# Altium schematic sheet BMS_STM32.SchDoc
size 431 x 279 mm; SheetNumber: 1; SheetTotal: 5
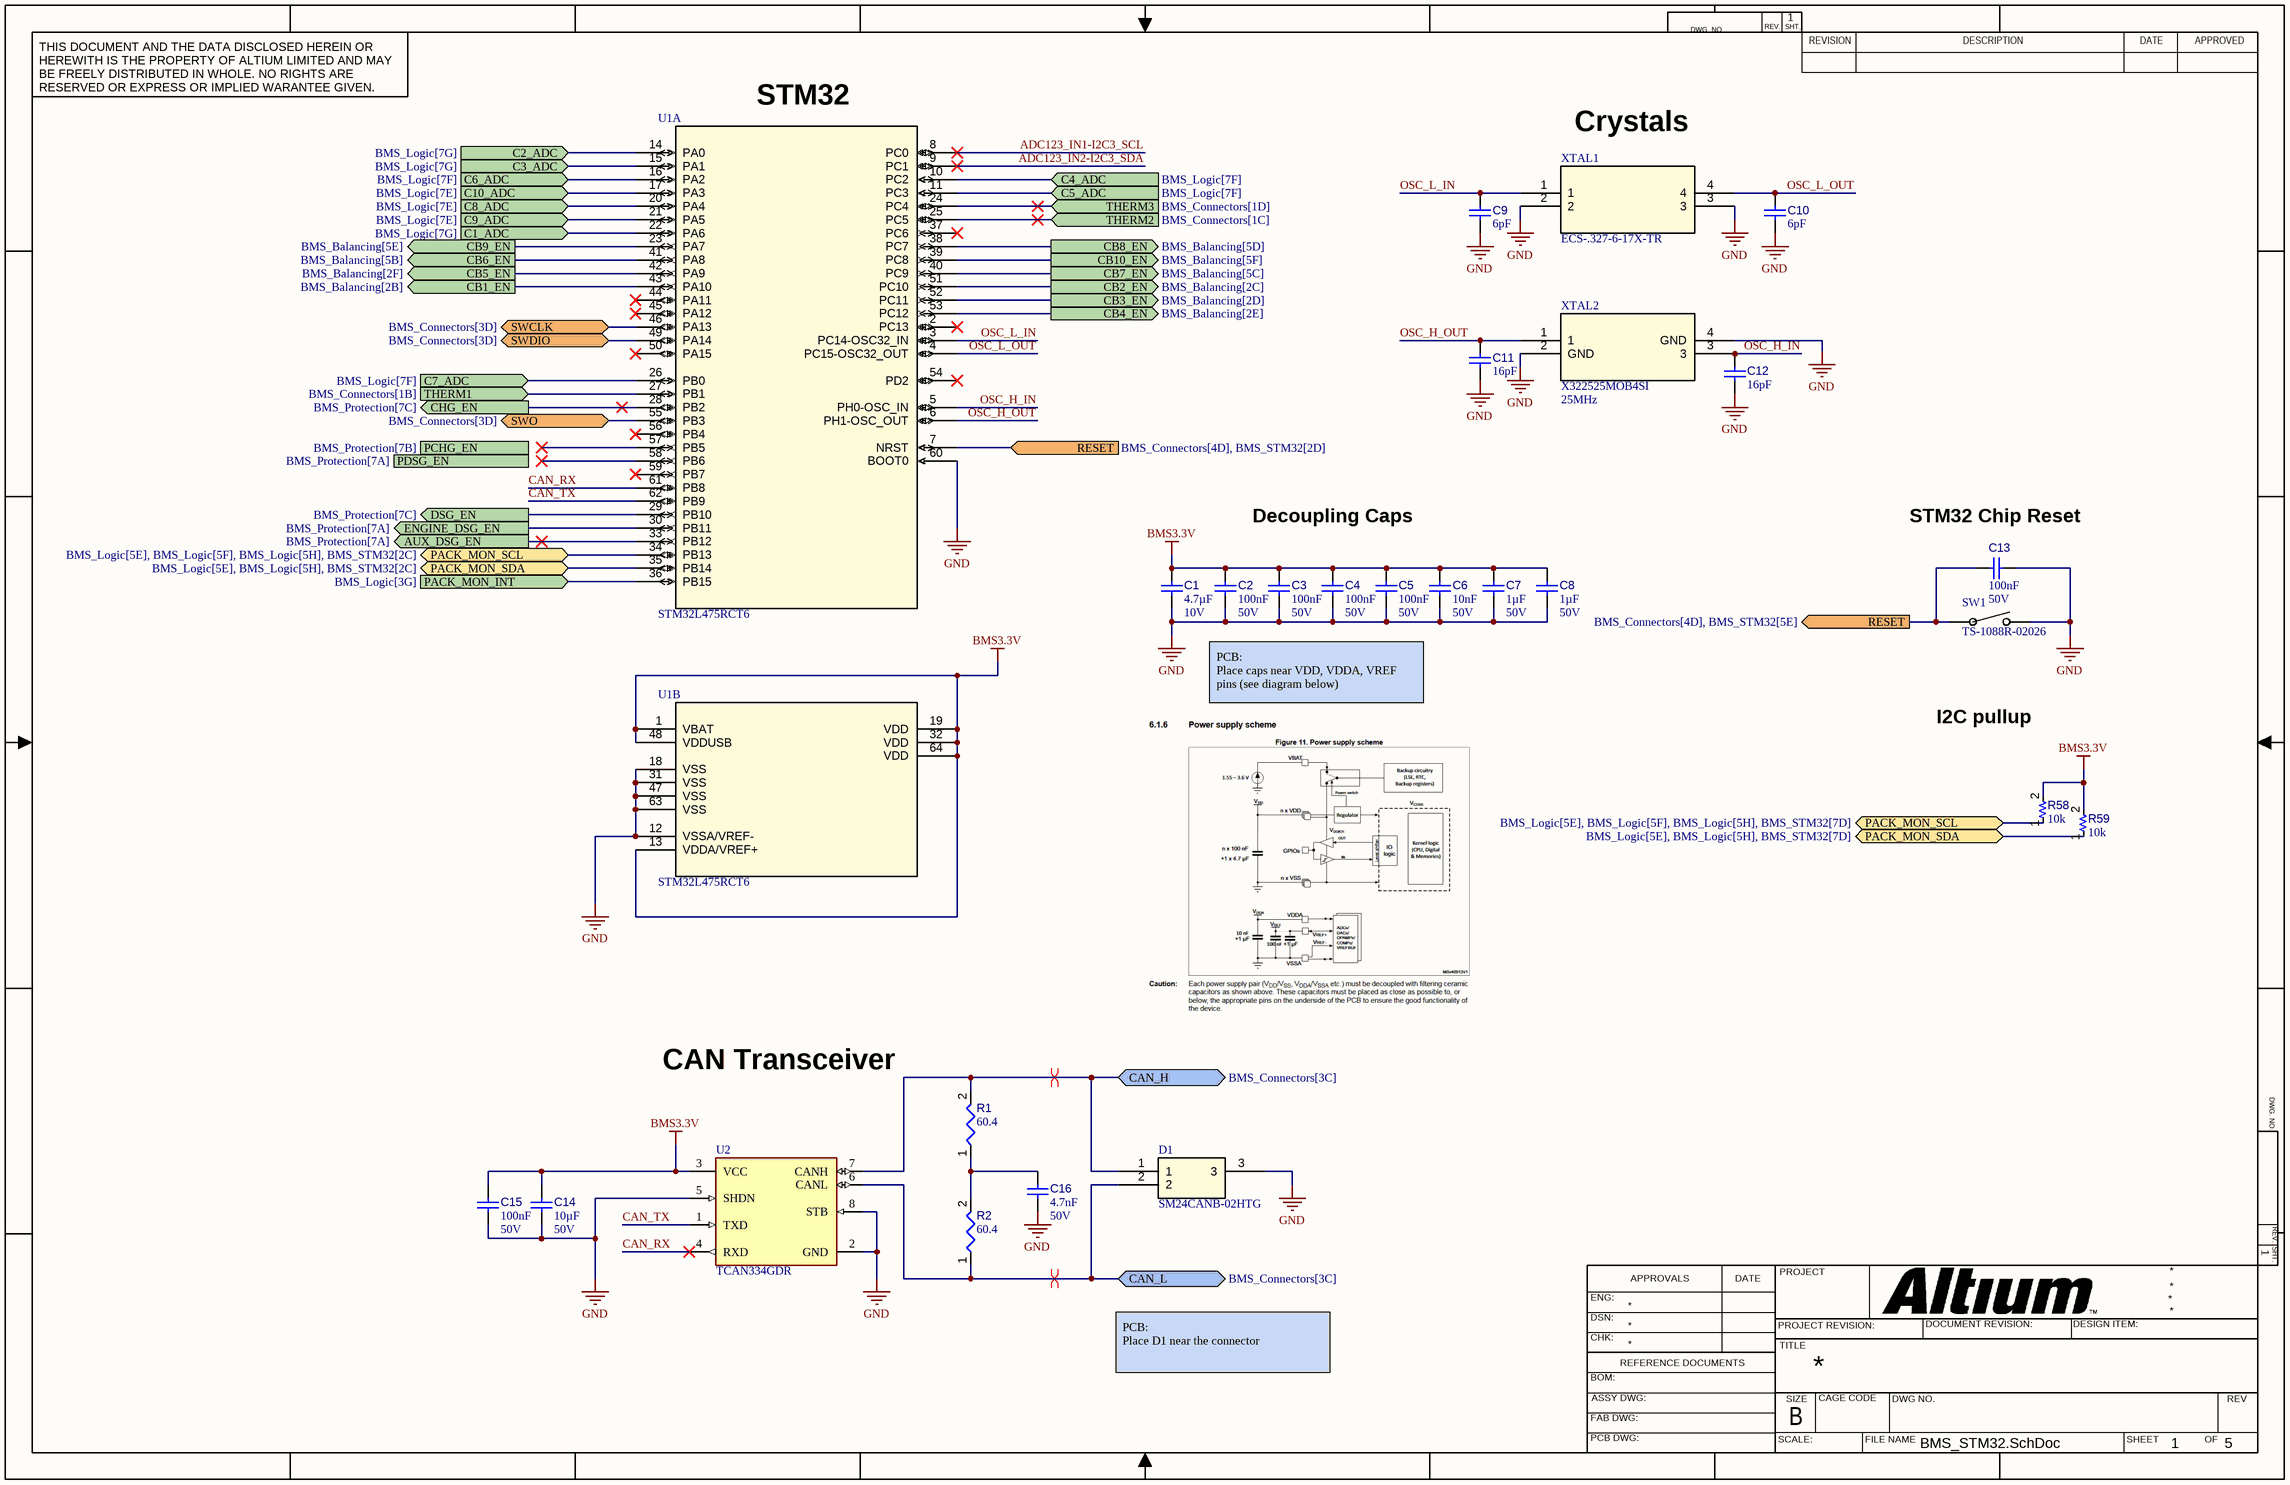
[diagram p0: BMS_STM32.SchDoc]

## Parts
C1  value 4.7µF  Voltage Rating: 10V  [CAPC0603(1608)100_L]  (hidden comment: Capacitor 4.7µF +/-20% 10V 0603)
C2  value 100nF  Voltage Rating: 50V  [CAPC0402(1005)60_L]  (hidden comment: Capacitor 100nF +/-20% 50V 0402)
C3  value 100nF  Voltage Rating: 50V  [CAPC0402(1005)60_L]  (hidden comment: Capacitor 100nF +/-20% 50V 0402)
C4  value 100nF  Voltage Rating: 50V  [CAPC0402(1005)60_L]  (hidden comment: Capacitor 100nF +/-20% 50V 0402)
C5  value 100nF  Voltage Rating: 50V  [CAPC0402(1005)60_L]  (hidden comment: Capacitor 100nF +/-20% 50V 0402)
C6  value 10nF  Voltage Rating: 50V  [CAPC0402(1005)60_L]  (hidden comment: Capacitor 10nF +/-20% 50V 0402)
C7  value 1µF  Voltage Rating: 50V  [CAPC0603(1608)100_L]  (hidden comment: Capacitor 1µF +/-40% 50V 0603)
C8  value 1µF  Voltage Rating: 50V  [CAPC0603(1608)100_L]  (hidden comment: Capacitor 1µF +/-40% 50V 0603)
C9  value 6pF  [CAPC1709X04N]  (hidden comment: Yageo CC0603CRNPO9BN6R0)
C10  value 6pF  [CAPC1709X04N]  (hidden comment: Yageo CC0603CRNPO9BN6R0)
C11  value 16pF  [CAPC1709X04N]  (hidden comment: Yageo CC0603JRNPO9BN160)
C12  value 16pF  [CAPC1709X04N]  (hidden comment: Yageo CC0603JRNPO9BN160)
C13  value 100nF  Voltage Rating: 50V  [CAPC0402(1005)60_L]  (hidden comment: Capacitor 100nF +/-20% 50V 0402)
C14  value 10µF  Voltage Rating: 50V  [CAPC0805(2012)145_L]  (hidden comment: Samsung Electro-Mechanics CL21A106KBYQNNE)
C15  value 100nF  Voltage Rating: 50V  [CAPC0402(1005)60_L]  (hidden comment: Capacitor 100nF +/-20% 50V 0402)
C16  value 4.7nF  Voltage Rating: 50V  [CAPC1709X04N]  (hidden comment: yageo CC0603KRX7R9BB472)
D1  SM24CANB-02HTG  [SOT23-3_SM24CANB-02HTG_LTF]
R1  value 60.4  [RESC1709X04N]  (hidden comment: yageo RC0603FR-0760R4L)
R2  value 60.4  [RESC1709X04N]  (hidden comment: yageo RC0603FR-0760R4L)
R58  value 10k  [RESC0402(1005)_L]  (hidden comment: RC0402FR-0710KL)
R59  value 10k  [RESC0402(1005)_L]  (hidden comment: RC0402FR-0710KL)
SW1  TS-1088R-02026  [SW_TS-1088R-02026_XNP]
U1  STM32L475RCT6  [LQFP64-10x10mm]  (parts A,B of 2)
U2  TCAN334GDR  [FP-D0008A-IPC_B]
XTAL1  ECS-.327-6-17X-TR  [XTAL_7X-TR_ECS]
XTAL2  X322525MOB4SI  Frequency: 25MHz  [SMT_MOB4SI_YXC]

## Ports
AUX_DSG_EN (out, see BMS_Protection[7A]), C1_ADC (in, see BMS_Logic[7G]), C2_ADC (in, see BMS_Logic[7G]), C3_ADC (in, see BMS_Logic[7G]), C4_ADC (in, see BMS_Logic[7F]), C5_ADC (in, see BMS_Logic[7F]), C6_ADC (in, see BMS_Logic[7F]), C7_ADC (in, see BMS_Logic[7F]), C8_ADC (in, see BMS_Logic[7E]), C9_ADC (in, see BMS_Logic[7E]), C10_ADC (in, see BMS_Logic[7E]), CAN_H (bidir, see BMS_Connectors[3C]), CAN_L (bidir, see BMS_Connectors[3C]), CB1_EN (out, see BMS_Balancing[2B]), CB2_EN (out, see BMS_Balancing[2C]), CB3_EN (out, see BMS_Balancing[2D]), CB4_EN (out, see BMS_Balancing[2E]), CB5_EN (out, see BMS_Balancing[2F]), CB6_EN (out, see BMS_Balancing[5B]), CB7_EN (out, see BMS_Balancing[5C]), CB8_EN (out, see BMS_Balancing[5D]), CB9_EN (out, see BMS_Balancing[5E]), CB10_EN (out, see BMS_Balancing[5F]), CHG_EN (out, see BMS_Protection[7C]), DSG_EN (out, see BMS_Protection[7C]), ENGINE_DSG_EN (out, see BMS_Protection[7A]), PACK_MON_INT (in, see BMS_Logic[3G]), PACK_MON_SCL (bidir, see BMS_Logic[5E], BMS_Logic[5F], BMS_Logic[5H], BMS_STM32[2C]), PACK_MON_SCL (bidir, see BMS_Logic[5E], BMS_Logic[5F], BMS_Logic[5H], BMS_STM32[7D]), PACK_MON_SDA (bidir, see BMS_Logic[5E], BMS_Logic[5H], BMS_STM32[2C]), PACK_MON_SDA (bidir, see BMS_Logic[5E], BMS_Logic[5H], BMS_STM32[7D]), PCHG_EN (out, see BMS_Protection[7B]), PDSG_EN (out, see BMS_Protection[7A]), RESET (in, see BMS_Connectors[4D], BMS_STM32[2D]), RESET (out, see BMS_Connectors[4D], BMS_STM32[5E]), SWCLK (bidir, see BMS_Connectors[3D]), SWDIO (bidir, see BMS_Connectors[3D]), SWO (bidir, see BMS_Connectors[3D]), THERM1 (in, see BMS_Connectors[1B]), THERM2 (in, see BMS_Connectors[1C]), THERM3 (in, see BMS_Connectors[1D])

## Nets
BMS3.3V: C1.1 C2.2 C3.2 C4.2 C5.2 C6.1 C7.1 C8.1 C14.1 C15.1 R58.2 R59.2 U1.1(VBAT) U1.13(VDDA/VREF+) U1.19(VDD) U1.32(VDD) U1.48(VDDUSB) U1.64(VDD) U2.3(VCC)
GND: C1.2 C2.1 C3.1 C4.1 C5.1 C6.2 C7.2 C8.2 C9.2 C10.2 C11.2 C12.1 C13.1 C14.2 C15.2 C16.2 D1.3 SW1.2 U1.12(VSSA/VREF-) U1.18(VSS) U1.31(VSS) U1.47(VSS) U1.60(BOOT0) U1.63(VSS) U2.2(GND) U2.5(SHDN) U2.8(STB) XTAL1.2 XTAL1.3 XTAL2.2(GND) XTAL2.4(GND)
ADC123_IN1-I2C3_SCL: U1.8(PC0)
ADC123_IN2-I2C3_SDA: U1.9(PC1)
AUX_DSG_EN: U1.33(PB12) ; port AUX_DSG_EN
C1_ADC: U1.22(PA6) ; port C1_ADC
C2_ADC: U1.14(PA0) ; port C2_ADC
C3_ADC: U1.15(PA1) ; port C3_ADC
C4_ADC: U1.10(PC2) ; port C4_ADC
C5_ADC: U1.11(PC3) ; port C5_ADC
C6_ADC: U1.16(PA2) ; port C6_ADC
C7_ADC: U1.26(PB0) ; port C7_ADC
C8_ADC: U1.20(PA4) ; port C8_ADC
C9_ADC: U1.21(PA5) ; port C9_ADC
C10_ADC: U1.17(PA3) ; port C10_ADC
CAN_H: D1.1 R1.2 U2.7(CANH) ; port CAN_H
CAN_L: D1.2 R2.1 U2.6(CANL) ; port CAN_L
CAN_RX: U1.61(PB8) U2.4(RXD)
CAN_TX: U1.62(PB9) U2.1(TXD)
CB1_EN: U1.43(PA10) ; port CB1_EN
CB2_EN: U1.51(PC10) ; port CB2_EN
CB3_EN: U1.52(PC11) ; port CB3_EN
CB4_EN: U1.53(PC12) ; port CB4_EN
CB5_EN: U1.42(PA9) ; port CB5_EN
CB6_EN: U1.41(PA8) ; port CB6_EN
CB7_EN: U1.40(PC9) ; port CB7_EN
CB8_EN: U1.38(PC7) ; port CB8_EN
CB9_EN: U1.23(PA7) ; port CB9_EN
CB10_EN: U1.39(PC8) ; port CB10_EN
CHG_EN: U1.28(PB2) ; port CHG_EN
DSG_EN: U1.29(PB10) ; port DSG_EN
ENGINE_DSG_EN: U1.30(PB11) ; port ENGINE_DSG_EN
OSC_H_IN: C12.2 U1.5(PH0-OSC_IN) XTAL2.3
OSC_H_OUT: C11.1 U1.6(PH1-OSC_OUT) XTAL2.1
OSC_L_IN: C9.1 U1.3(PC14-OSC32_IN) XTAL1.1
OSC_L_OUT: C10.1 U1.4(PC15-OSC32_OUT) XTAL1.4
PACK_MON_INT: U1.36(PB15) ; port PACK_MON_INT
PACK_MON_SCL: R58.1 U1.34(PB13) ; port PACK_MON_SCL
PACK_MON_SDA: R59.1 U1.35(PB14) ; port PACK_MON_SDA
RESET: C13.2 SW1.1 U1.7(NRST) ; port RESET
SWCLK: U1.46(PA13) ; port SWCLK
SWDIO: U1.49(PA14) ; port SWDIO
SWO: U1.55(PB3) ; port SWO
THERM1: U1.27(PB1) ; port THERM1
THERM2: U1.25(PC5) ; port THERM2
THERM3: U1.24(PC4) ; port THERM3
NetC16_1: C16.1 R1.1 R2.2

Not connected (* = marked no-connect by the designer): U1 2(PC13)* 37(PC6)* 44(PA11)* 45(PA12)* 50(PA15)* 54(PD2)* 56(PB4)* 57(PB5)* 58(PB6)* 59(PB7)*

## Layout directives
differential pair: CAN_H, CAN_L

## Notes on the sheet
- (near U1) STM32
- Crystals
- Decoupling Caps
- (near C13) STM32 Chip Reset
- PCB:
  Place caps near VDD, VDDA, VREF pins (see diagram below)
- I2C pullup
- CAN Transceiver
- PCB:
  Place D1 near the connector
- DWG. NO.
- REV.
- SHT.
- THIS DOCUMENT AND THE DATA DISCLOSED HEREIN OR HEREWITH IS THE PROPERTY OF ALTIUM LIMITED AND MAY BE FREELY DISTRIBUTED IN WHOLE. NO RIGHTS ARE RESERVED OR EXPRESS OR IMPLIED WARANTEE GIVEN.
- REVISION
- DESCRIPTION
- DATE
- APPROVED
- ENG:
- APPROVALS
- PROJECT
- DSN:
- CHK:
- REFERENCE DOCUMENTS
- PROJECT REVISION:
- TITLE
- DOCUMENT REVISION:
- DESIGN ITEM:
- BOM:
- FAB DWG:
- PCB DWG:
- ASSY DWG:
- SCALE:
- SIZE
- B
- CAGE CODE
- FILE NAME
- DWG NO.
- SHEET
- OF
- REV

## Library data of the parts
C1 = CMP-001-00076-4: Chip Capacitor, 4.7µF +/-20%, 10V, 0603, Thickness 1 mm; Tolerance: 10%; Mounting Technology: SMT; Case/Package: 0603; Pins: 2; Min Operating Temperature: -55°C; Max Operating Temperature: 85°C
C2-C5 C13 C15 = CMP-001-00067-3: Chip Capacitor, 100nF +/-20%, 50V, 0402, Thickness 0.6 mm; Tolerance: 10%; Min Operating Temperature: -55°C; Pins: 2; Case/Package: 0402; Max Operating Temperature: 85°C; Mounting Technology: SMT
C6 = CMP-001-00069-3: Chip Capacitor, 10nF +/-20%, 50V, 0402, Thickness 0.6 mm; Tolerance: 5%; Max Operating Temperature: 85°C; Pins: 2; Case/Package: 0402; Min Operating Temperature: -55°C; Mounting Technology: SMT
C7 C8 = CMP-001-00078-4: Chip Capacitor, 1µF +/-40%, 50V, 0603, Thickness 1 mm; Tolerance: 10%; Case/Package: 0603; Pins: 2; Max Operating Temperature: 85°C; Mounting Technology: SMT; Min Operating Temperature: -55°C
C9 C10 = CMP-001-00085-2: Ceramic Capacitor, Multilayer, Ceramic, 50V, 4.17% +Tol, 4.17% -Tol, C0G, -/+30ppm/Cel TC, 0.000006uF, Surface Mount, 0603; Pins: 2; Capacitor Type: Ceramic; Case/Package: 0603; Mounting Technology: Surface Mount; RoHS Compliant: Yes; Min Operating Temperature: -55°C; Max Operating Temperature: 125°C
C11 C12 = CMP-001-00087-3: Multilayer Ceramic Capacitor, 16 pF, 50 V, ± 5%, C0G (NP0), 0603 [1608 Metric]
C14 = CMP-001-00079-4: Chip Capacitor, 10µF +/-20%, 25V, 0805, Thickness 1.45 mm; Tolerance: 10%; Max Operating Temperature: 85°C; Case/Package: 0805; Min Operating Temperature: -55°C; Mounting Technology: SMT; Pins: 2
C16 = CMP-001-00083-3: Ceramic Capacitor, Multilayer, Ceramic, 50V, 10% +Tol, 10% -Tol, X7R, 15% TC, 0.0047uF, Surface Mount, 0603; Max Operating Temperature: 125°C; RoHS Compliant: Yes; Case/Package: 0603; Mounting Technology: Surface Mount; Pins: 2; Capacitor Type: Ceramic; Min Operating Temperature: -55°C
D1 = CMP-054-000000-3: No Description Available; Manufacturer_Name: Littelfuse Inc; Source: SM24CANB-02HTG.SchLib; Manufacturer_Part_Number: SM24CANB-02HTG; Design Item ID: SM24CANB-02HTG; RefDes: RefDes; Copyright: Copyright (C) 2025 Ultra Librarian. All rights reserved.; Type: Type
R1 R2 = CMP-009-00177-3: Fixed Resistor, Metal Glaze/thick Film, 0.1W, 60.4ohm, 75V, 1% +/-Tol, 100ppm/Cel, Surface Mount, 0603; Power: 100mW; Max Operating Temperature: 155°C; Pins: 2; Tolerance: 1%; RoHS Compliant: Yes; Min Operating Temperature: -55°C; Mounting Technology: Surface Mount; Case/Package: 0603
R58 R59 = CMP-009-00065-4: 100R 0.063W 1% 0402 (1005 Metric)  SMD; Power: 63mW; Mounting Technology: SMT; Case/Package: 0402; Pins: 2; Tolerance: 1%
SW1 = CMP-011-00013-1: No Description Available; Manufacturer_Name: Xunpu; Design Item ID: TS-1088R-02026; Copyright: Copyright (C) 2025 Ultra Librarian. All rights reserved.; Manufacturer_Part_Number: TS-1088R-02026; Type: Tactile Switches; Source: TS-1088R-02026.SchLib
U1 = CMP-031-00008-2: Ultra-low-power with FPU Arm Cortex-M4 MCU 80 MHz with 256 Kbytes of Flash memory, USB OTG, DFSDM; Manufacturer_Name: STMicroelectronics; Design Item ID: STM32L475RCT6; Manufacturer_Part_Number: STM32L475RCT6; Source: STM32L475RCT6.SchLib; RefDes: RefDes; Copyright: Copyright (C) 2025 Ultra Librarian. All rights reserved.; Type: Type; Datasheet: https://www.st.com/resource/en/datasheet/stm32l475rc.pdf; RoHS Compliant: Yes
U2 = CMP-015-00009-1: Interface Circuit, PDSO8; Nominal Supply Voltage: 3.3V; Min Operating Temperature: -40°C; RoHS Compliant: Yes; Max Operating Temperature: 125°C; Pins: 8; Case/Package: SOP
XTAL1 = CMP-036-000000-1: No Description Available; Manufacturer_Name: ECS International; Copyright: Copyright (C) 2025 Ultra Librarian. All rights reserved.; Manufacturer_Part_Number: ECS-.327-6-17X-TR; Design Item ID: ECS-.327-6-17X-TR; Source: ECS-P327-6-17X-TR.SchLib; RefDes: RefDes; Type: Type
XTAL2 = CMP-039-000000-5: No Description Available; Manufacturer_Name: YXC; Design Item ID: X322525MOB4SI; Copyright: Copyright (C) 2025 Ultra Librarian. All rights reserved.; Source: X322525MOB4SI.SchLib; Type: Type; RefDes: RefDes; Manufacturer_Part_Number: X322525MOB4SI